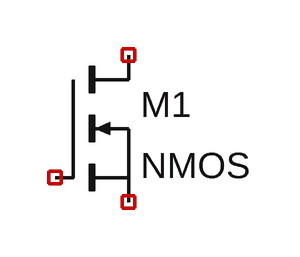
[diagram p0: schematic port_status_led.asc]
port_status_led.asc, the LTspice schematic file:
Version 4
SHEET 1 880 680
SYMBOL nmos 112 144 R0
SYMATTR InstName M1

The netlist it stands for:
* port_status_led.asc
M1 NC_01 NC_02 NC_03 NC_03 NMOS
.model NMOS NMOS
.model PMOS PMOS
.lib standard.mos
.backanno
.end